# EasyEDA schematic 1-Schematic_Power Supply Hub with INA219.json
TITLE: Power Supply Hub with INA219; REV: 1.0; Date: 2020-01-31; Sheet: 1/1; Drawn By: lferreira; Company: LSC
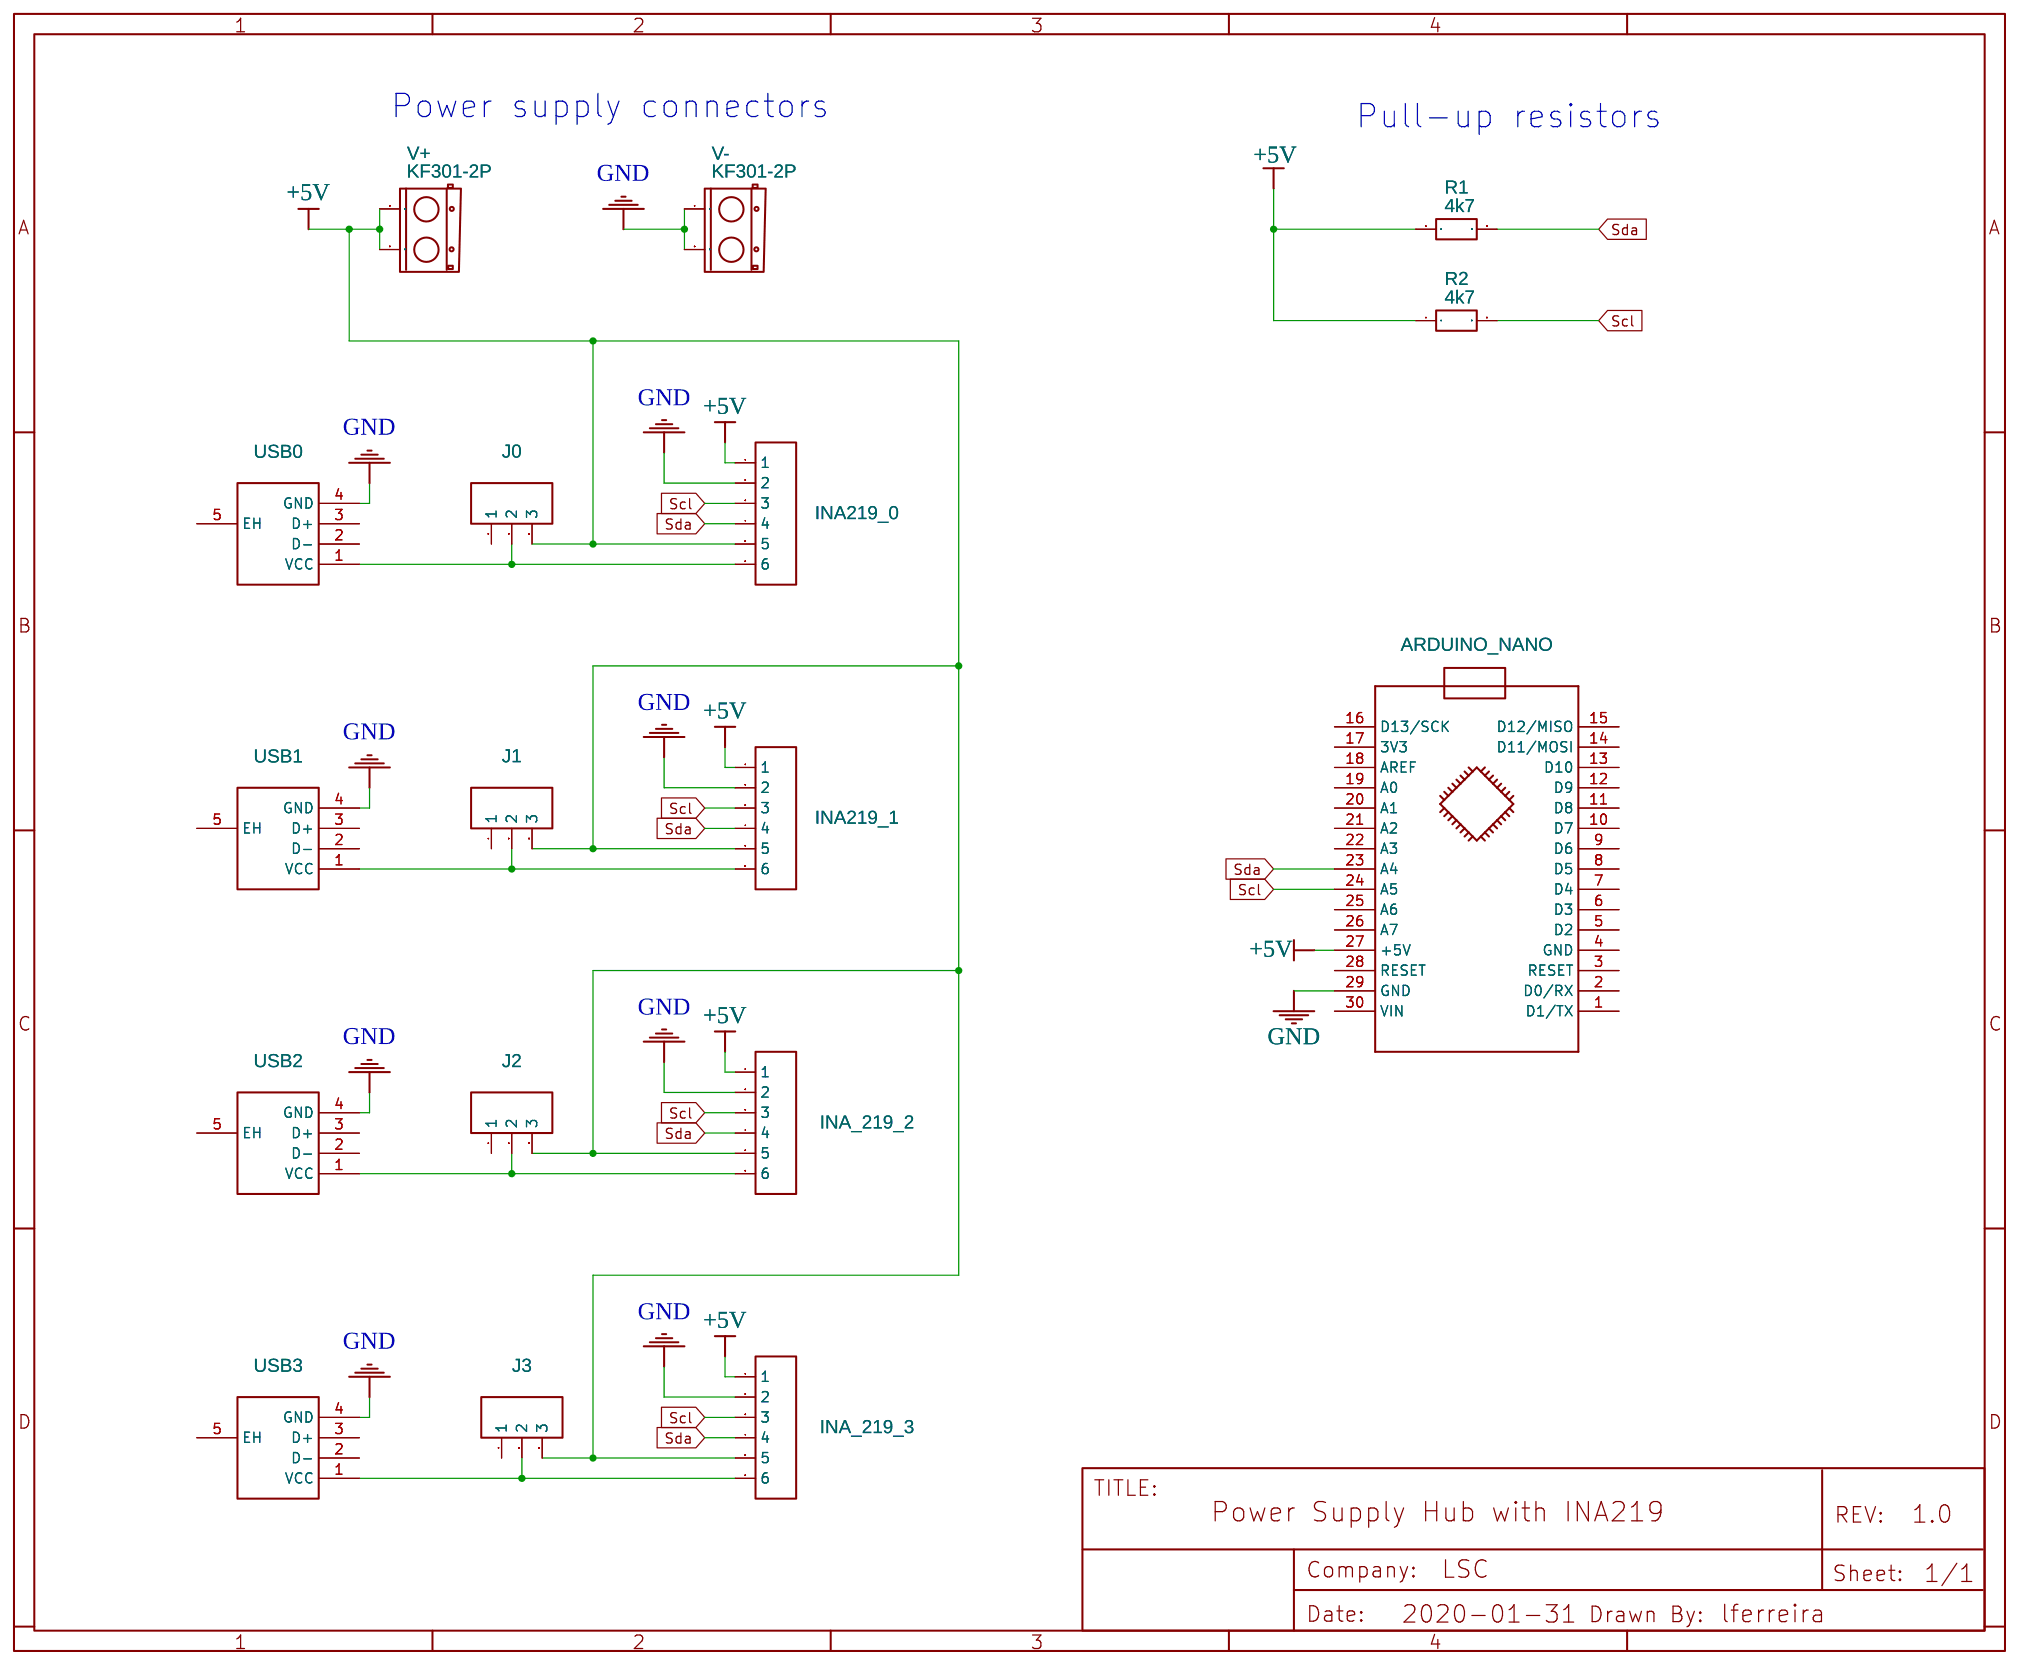
[diagram p0: schematic sheet]

## Parts
INA219_0  Header-Female-2.54_1x6  [HDR-6X1/2.54]
INA219_1  Header-Female-2.54_1x6  [HDR-6X1/2.54]
INA_219_2  Header-Female-2.54_1x6  [HDR-6X1/2.54]
INA_219_3  Header-Female-2.54_1x6  [HDR-6X1/2.54]
J0  Header-Male-2.54_1x3  [HDR-TH_3P-P2.54-V]
J1  Header-Male-2.54_1x3  [HDR-TH_3P-P2.54-V]
J2  Header-Male-2.54_1x3  [HDR-TH_3P-P2.54-V]
J3  Header-Male-2.54_1x3  [HDR-TH_3P-P2.54-V]
R1  4k7  [AXIAL-0.4]
R2  4k7  [AXIAL-0.4]
U1  ARDUINO_NANO  [ARDUINO_NANO]
USB0  FUS230-FDBW1K  [USB-A-TH_FUS230-FDBW1K]
USB1  FUS230-FDBW1K  [USB-A-TH_FUS230-FDBW1K]
USB2  FUS230-FDBW1K  [USB-A-TH_FUS230-FDBW1K]
USB3  FUS230-FDBW1K  [USB-A-TH_FUS230-FDBW1K]
V+  KF301-2P  [KF301-2P]
V-  KF301-2P  [KF301-2P]

## Library data of the parts
INA219_0 INA219_1 INA_219_2 INA_219_3 = Header-Female-2.54_1x6: Supplier: LCSC; Manufacturer: BOOMELE; Manufacturer Part: Female header 1*6p; Supplier Part: C40877
J0-J3 = Header-Male-2.54_1x3: Supplier: LCSC; Manufacturer: BOOMELE; Manufacturer Part: Header2.54mm 1*3P; image: //image.lceda.cn/szlcsc/C49257.jpg; Supplier Part: C49257
R1 = Res_AXIAL-0.4(1/4W)_EU: Supplier: LCSC
R2 = Res_AXIAL-0.4(1/4W)_EU
U1 = ARDUINO_NANO: sourceId: KGSeAWhDB
USB0-USB3 = FUS230-FDBW1K: Supplier: LCSC; Supplier Part: C456331; Manufacturer: TXGA; Contributor: LCSC
V+ = KF301-2P: Manufacturer Part: KF301; Contributor: Wiinart
V- = KF301-2P: Manufacturer Part: KF301; Contributor: Wiinart; Package Display: No

## Nets
+5V: INA219_0.1 INA219_0.5 INA219_1.1 INA219_1.5 INA_219_2.1 INA_219_2.5 INA_219_3.1 INA_219_3.5 J0.3 J1.3 J2.3 J3.3 R1.1 R2.1 U1.27(+5V) V+.1 V+.2
GND: INA219_0.2 INA219_1.2 INA_219_2.2 INA_219_3.2 U1.29(GND) USB0.4(GND) USB1.4(GND) USB2.4(GND) USB3.4(GND) V-.1 V-.2
Scl: INA219_0.3 INA219_1.3 INA_219_2.3 INA_219_3.3 R2.2 U1.24(A5)
Sda: INA219_0.4 INA219_1.4 INA_219_2.4 INA_219_3.4 R1.2 U1.23(A4)
Net-(INA219_0-6): INA219_0.6 J0.2 USB0.1(VCC)
Net-(INA219_1-6): INA219_1.6 J1.2 USB1.1(VCC)
Net-(INA_219_2-6): INA_219_2.6 J2.2 USB2.1(VCC)
Net-(INA_219_3-6): INA_219_3.6 J3.2 USB3.1(VCC)

Not connected (* = marked no-connect by the designer): J0 1; J1 1; J2 1; J3 1; U1 1(D1/TX) 2(D0/RX) 3(RESET) 4(GND) 5(D2) 6(D3) 7(D4) 8(D5) 9(D6) 10(D7) 11(D8) 12(D9) 13(D10) 14(D11/MOSI) 15(D12/MISO) 16(D13/SCK) 17(3V3) 18(AREF) 19(A0) 20(A1) 21(A2) 22(A3) 25(A6) 26(A7) 28(RESET) 30(VIN); USB0 2(D-) 3(D+) 5(EH); USB1 2(D-) 3(D+) 5(EH); USB2 2(D-) 3(D+) 5(EH); USB3 2(D-) 3(D+) 5(EH)

## Notes on the sheet
- Power supply connectors
- Pull-up resistors
